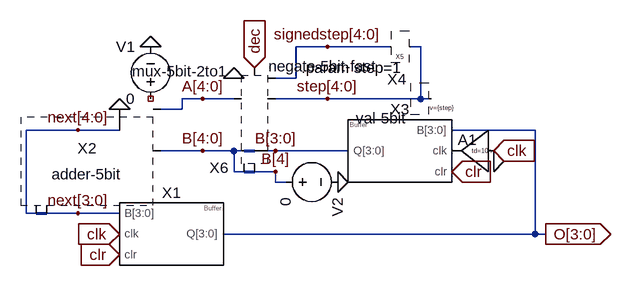
[diagram p0: schematic updown_4bitcounter-step.asc]
updown_4bitcounter-step.asc, the LTspice schematic file:
Version 4
SHEET 1 1396 984
WIRE 144 288 96 288
WIRE 240 288 144 288
WIRE 288 288 272 288
WIRE 96 336 96 288
WIRE 96 336 64 336
WIRE -48 368 -80 368
WIRE 0 368 -48 368
WIRE 144 368 64 368
WIRE 288 368 288 288
WIRE 288 368 144 368
WIRE 304 368 288 368
WIRE -80 384 -80 368
WIRE -80 384 -112 384
WIRE -240 416 -320 416
WIRE -176 416 -240 416
WIRE 464 416 336 416
WIRE -48 448 -112 448
WIRE 0 448 -48 448
WIRE 16 448 0 448
WIRE 64 448 32 448
WIRE 176 448 64 448
WIRE 0 480 0 448
WIRE 16 480 0 480
WIRE 64 480 32 480
WIRE 64 496 64 480
WIRE 80 496 64 496
WIRE -320 544 -320 416
WIRE -304 544 -320 544
WIRE -240 544 -288 544
WIRE -176 544 -240 544
WIRE 464 576 464 416
WIRE 464 576 -16 576
WIRE 480 576 464 576
FLAG 480 576 O[3:0]
IOPIN 480 576 Out
FLAG 32 320 dec
IOPIN 32 320 In
FLAG -176 576 clk
IOPIN -176 576 In
FLAG -128 288 0
FLAG -176 384 0
FLAG -240 416 next[4:0]
FLAG 400 464 0
FLAG 400 448 clk
IOPIN 400 448 In
FLAG 64 448 B[3:0]
FLAG 144 368 step[4:0]
FLAG 144 288 signedstep[4:0]
FLAG 0 336 0
FLAG -48 368 A[4:0]
FLAG -176 608 clr
IOPIN -176 608 In
FLAG 336 480 clr
IOPIN 336 480 In
FLAG -240 544 next[3:0]
FLAG 160 496 0
FLAG -48 448 B[4:0]
FLAG 64 480 B[4]
BUSTAP -304 544 -288 544
BUSTAP 16 448 32 448
BUSTAP 16 480 32 480
SYMBOL dbuf_4bit -96 576 R0
SYMATTR InstName X1
SYMBOL voltage -128 384 R180
WINDOW 0 24 96 Left 2
WINDOW 3 24 16 Left 2
WINDOW 123 0 0 Left 0
WINDOW 39 0 0 Left 0
SYMATTR InstName V1
SYMATTR Value 0
SYMBOL dbuf_4bit 256 448 M0
SYMATTR InstName X3
SYMBOL Digital\\buf1 400 384 M0
WINDOW 0 26 47 Left 2
WINDOW 3 2 64 Left 0
SYMATTR InstName A1
SYMATTR Value td=10n
SYMBOL val-5bit 320 368 M0
WINDOW 39 0 20 Bottom 0
SYMATTR SpiceLine v={step}
SYMATTR InstName X4
SYMBOL adder-5bit -144 416 M0
SYMATTR InstName X2
SYMBOL negate-5bit-fast 256 288 M0
WINDOW 0 0 9 Top 0
SYMATTR InstName X5
SYMBOL mux-5bit-2to1 32 352 R180
SYMATTR InstName X6
SYMBOL voltage 64 496 M90
WINDOW 0 24 96 Left 2
WINDOW 3 24 16 Left 2
WINDOW 123 0 0 Left 0
WINDOW 39 0 0 Left 0
SYMATTR InstName V2
SYMATTR Value 0
TEXT 104 320 Left 2 !.param step=1

The netlist it stands for:
* updown_4bitcounter-step.asc
XX1 next[3] next[2] next[1] next[0] clk clr O[3] O[2] O[1] O[0] dbuf_4bit  ; pins B[3:0] clk clr Q[3:0]
V1 NC_01 0 0
XX3 O[3] O[2] O[1] O[0] P001 clr B[3] B[2] B[1] B[0] dbuf_4bit  ; pins B[3:0] clk clr Q[3:0]
A1 clk 0 0 0 0 0 P001 0 BUF td=10n
* X4: val-5bit v={step} (symbol val-5bit not available, pin order unknown); nets seen at it: step[4:0]
* X2: adder-5bit (symbol adder-5bit not available, pin order unknown); nets seen at it: 0, A[4:0], B[4:0], next[3:0], next[4:0]
* X5: negate-5bit-fast (symbol negate-5bit-fast not available, pin order unknown); nets seen at it: signedstep[4:0], step[4:0]
* X6: mux-5bit-2to1 (symbol mux-5bit-2to1 not available, pin order unknown); nets seen at it: 0, A[4:0], B[3:0], B[4:0], B[4], dec, signedstep[4:0], step[4:0]
V2 B[4] 0 0
.param step=1
.backanno
.end